# Altium schematic sheet Schematic.SchDoc
size A4
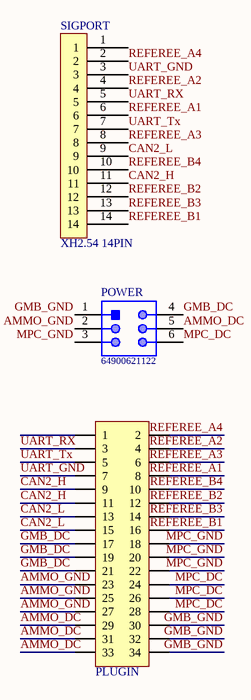
[diagram p0: Schematic.SchDoc]

## Parts
PLUGIN  Header 2X11  [IDC2.54-LI-2x17P]  (value not drawn)
POWER  64900621122  [64900621122]
SIGPORT  XH2.54 14PIN  [DC-2.54-L-Z-14P]

## Nets
AMMO_DC: PLUGIN.29 PLUGIN.31 PLUGIN.33 POWER.5
AMMO_GND: PLUGIN.23 PLUGIN.25 PLUGIN.27 POWER.2
CAN2_H: PLUGIN.9 PLUGIN.11 SIGPORT.11
CAN2_L: PLUGIN.13 PLUGIN.15 SIGPORT.9
GMB_DC: PLUGIN.17 PLUGIN.19 PLUGIN.21 POWER.4
GMB_GND: PLUGIN.30 PLUGIN.32 PLUGIN.34 POWER.1
MPC_DC: PLUGIN.24 PLUGIN.26 PLUGIN.28 POWER.6
MPC_GND: PLUGIN.18 PLUGIN.20 PLUGIN.22 POWER.3
REFEREE_A1: PLUGIN.8 SIGPORT.6
REFEREE_A2: PLUGIN.4 SIGPORT.4
REFEREE_A3: PLUGIN.6 SIGPORT.8
REFEREE_A4: PLUGIN.2 SIGPORT.2
REFEREE_B1: PLUGIN.16 SIGPORT.14
REFEREE_B2: PLUGIN.12 SIGPORT.12
REFEREE_B3: PLUGIN.14 SIGPORT.13
REFEREE_B4: PLUGIN.10 SIGPORT.10
UART_GND: PLUGIN.7 SIGPORT.3
UART_RX: PLUGIN.3 SIGPORT.5
UART_Tx: PLUGIN.5 SIGPORT.7

Not connected (* = marked no-connect by the designer): PLUGIN 1; SIGPORT 1

## Library data of the parts
PLUGIN = Header 17X2: 17*2P接插件; 版权归属: 封装库来自淘宝 ID：黄晶宝石; BOM名称: 17*2P接插件; 学习资源: https://shop463601444.taobao.com
POWER = CMP-1502-00495-1: THT Male Header WR-MPC4, Vertical, Dual Row, pitch 4.2 mm, 6 pins; Manufacturer: Wurth Elektronik; Pin Number: 6; Pitch: 4.2mm; Working Voltage: 600VAC; Contact Resistance: 10mOhm; Packaging: Tray; Orientation: Vertical; Gender: Male; Manufacturer URL: http://www.we-online.de; Operating Temperature: -40to105degC; Publisher: WurthElektronik; Part Number: 64900621122; Mounting Technology: THT; Datasheet URL: https://katalog.we-online.de/em/datasheet/6490xx21122.pdf; Package Reference: 64900621122